# EAGLE design RFM50_Breakout_0 (EAGLE 6.3)
RFM50 Breakout Board w/SMD Crystal
AUTHOR: Pasakorn Tiwatthanont
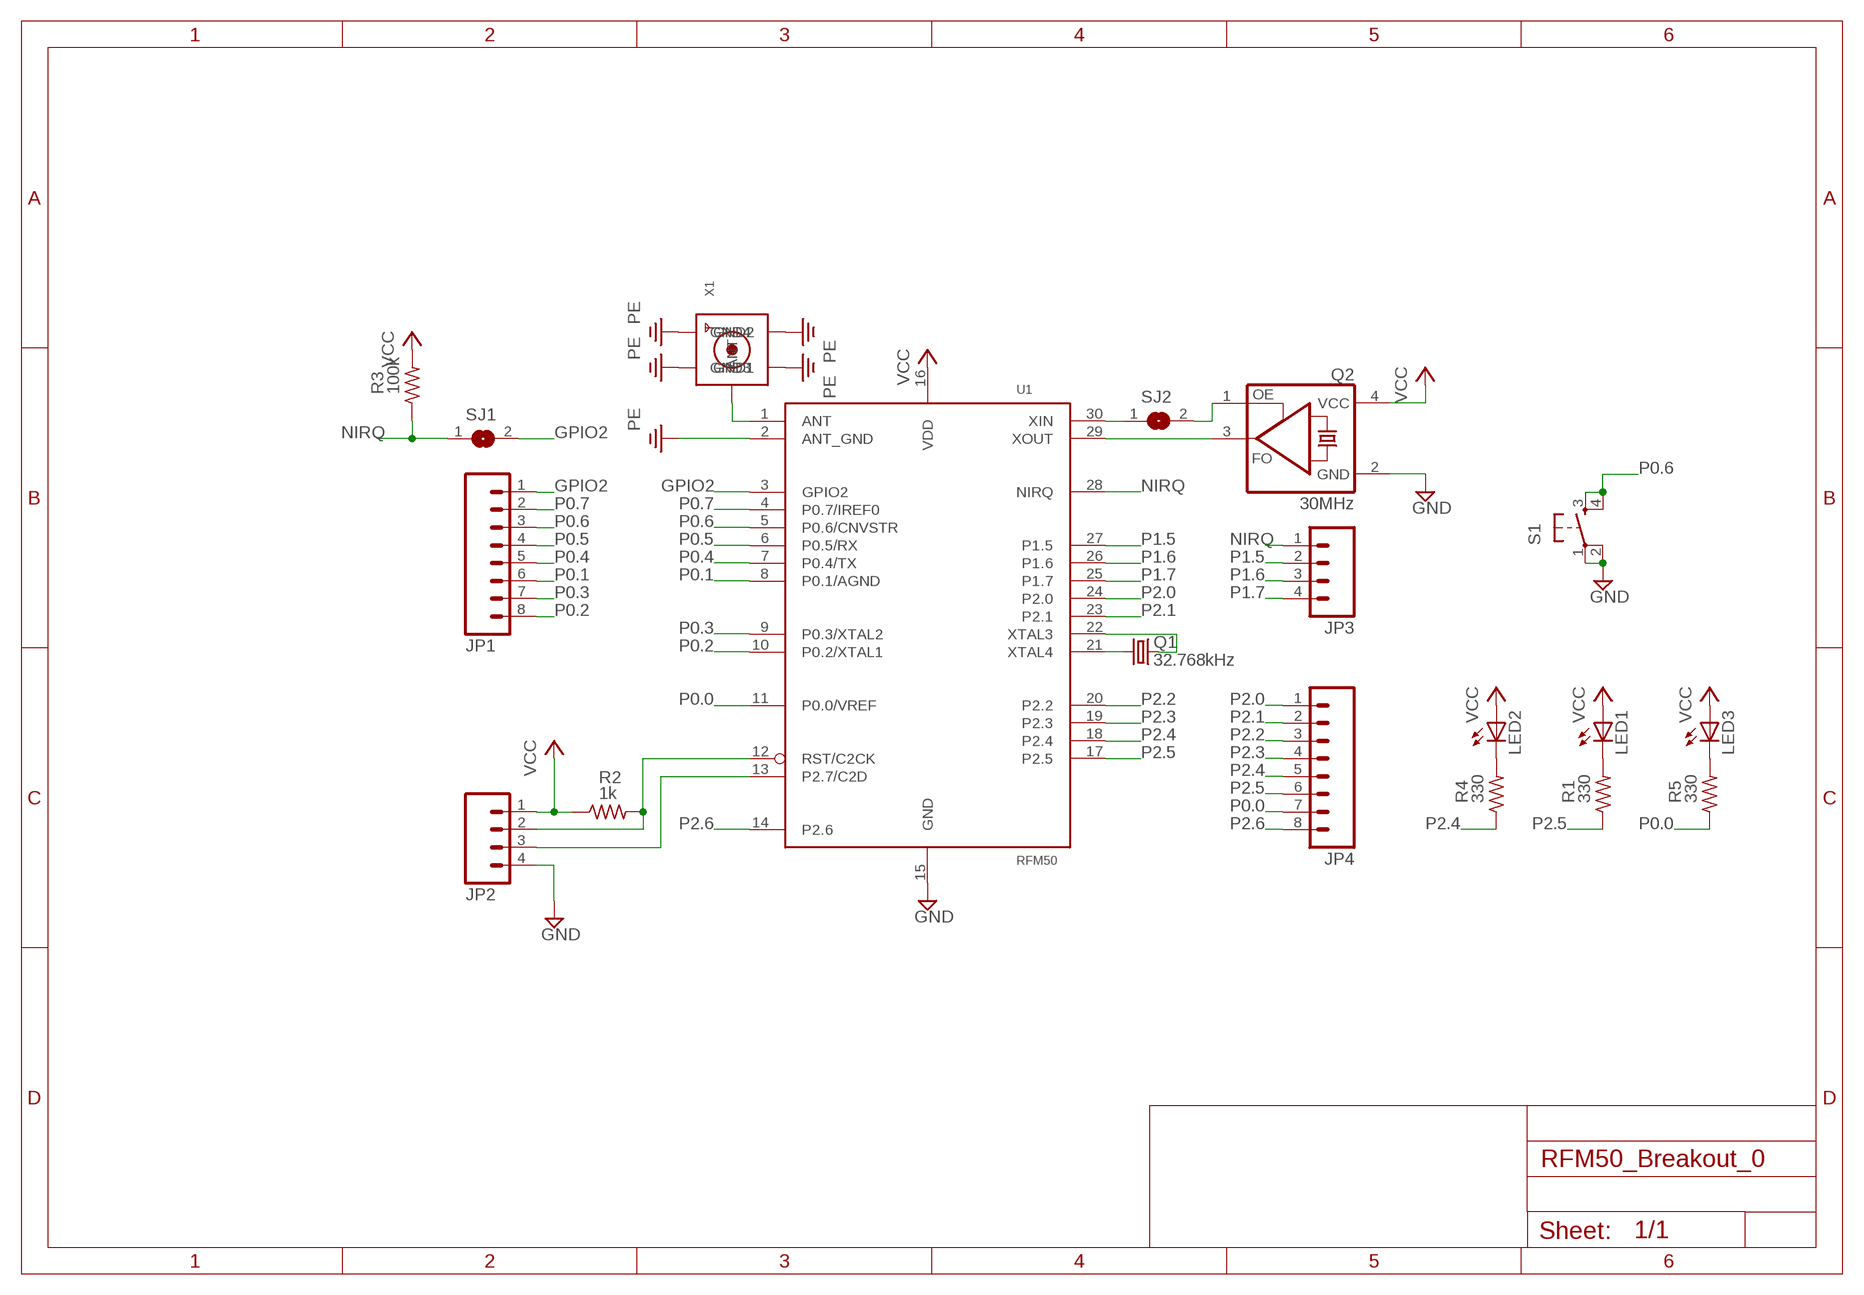
[diagram p0: schematic, sheet 1]

## Parts
JP1  M081X08  [1X08]
JP2  M04PTH  [1X04]
JP3  M04PTH  [1X04]
JP4  M081X08  [1X08]
LED1  LED3MM  [LED3MM]
LED2  LED3MM  [LED3MM]
LED3  LED3MM  [LED3MM]
Q1  32.768kHz  CRYSTALTC26H  [TC26H]
Q2  30MHz  ASFL  [ASF]
R1  330  RCL_R-US_0204/2V  [RCL_0204V]
R2  1k  RCL_R-US_0204/2V  [RCL_0204V]
R3  100k  RCL_R-US_R0805  [RCL_R0805]
R4  330  RCL_R-US_0204/2V  [RCL_0204V]
R5  330  RCL_R-US_0204/2V  [RCL_0204V]
S1  SWITCH-TACT_DTS-6  [SWITCH-TACT_DTS-6]
SJ1  SJ  [SJ]
SJ2  SJ  [SJ]
U1  RFM50  [RFM50]
X1  SMACONNECTOR  [SMA90_DIP]

## Nets
GND: JP2.4 Q2.2(GND) S1.1 S1.2 U1.15(GND)
GPIO2: JP1.1 SJ1.2 U1.3(GPIO2)
N$1: U1.1(ANT) X1.ANTENNA(ANT)
N$2: JP2.2 R2.2 U1.12(RST/C2CK)
N$3: LED1.K(C) R1.2
N$4: Q2.3(FO) U1.29(XOUT)
N$5: Q2.1(OE) SJ2.2
N$6: Q1.2 U1.21(XTAL4)
N$7: Q1.1 U1.22(XTAL3)
N$8: SJ2.1 U1.30(XIN)
N$9: JP2.3 U1.13(P2.7/C2D)
N$10: LED2.K(C) R4.2
N$11: LED3.K(C) R5.2
NIRQ: JP3.1 R3.1 SJ1.1 U1.28(NIRQ)
P0.0: JP4.7 R5.1 U1.11(P0.0/VREF)
P0.1: JP1.6 U1.8(P0.1/AGND)
P0.2: JP1.8 U1.10(P0.2/XTAL1)
P0.3: JP1.7 U1.9(P0.3/XTAL2)
P0.4: JP1.5 U1.7(P0.4/TX)
P0.5: JP1.4 U1.6(P0.5/RX)
P0.6: JP1.3 S1.3 S1.4 U1.5(P0.6/CNVSTR)
P0.7: JP1.2 U1.4(P0.7/IREF0)
P1.5: JP3.2 U1.27(P1.5)
P1.6: JP3.3 U1.26(P1.6)
P1.7: JP3.4 U1.25(P1.7)
P2.0: JP4.1 U1.24(P2.0)
P2.1: JP4.2 U1.23(P2.1)
P2.2: JP4.3 U1.20(P2.2)
P2.3: JP4.4 U1.19(P2.3)
P2.4: JP4.5 R4.1 U1.18(P2.4)
P2.5: JP4.6 R1.1 U1.17(P2.5)
P2.6: JP4.8 U1.14(P2.6)
PE: U1.2(ANT_GND) X1.GND1 X1.GND2 X1.GND3 X1.GND4
VCC: JP2.1 LED1.A LED2.A LED3.A Q2.4(VCC) R2.1 R3.2 U1.16(VDD)

## Library data of the parts
JP1 JP4 = SparkFun-Connectors:M08: Header 8 Standard 8-pin 0.1" header. Use with straight break away headers (SKU : PRT-00116), right angle break away headers (PRT-00553), swiss pins (PRT-00743), machine pins (PRT-00117), and female headers (PRT-00115).
JP2 JP3 = ipas:M04: Header 4 Standard 4-pin 0.1" header. Use with straight break away headers (SKU : PRT-00116), right angle break away headers (PRT-00553), swiss pins (PRT-00743), machine pins (PRT-00117), and female headers (PRT-00115). Molex polarized connector foot print use with SKU : PRT-08231 with associated crimp pins and housings. 1MM SMD Version SKU: PRT-10208
LED1-LED3 = led:LED: LED OSRAM: - CHIPLED LG R971, LG N971, LY N971, LG Q971, LY Q971, LO R971, LY R971 LH N974, LH R974 LS Q976, LO Q976, LY Q976 LO Q996 - Hyper CHIPLED LW Q18S LB Q993, LB Q99A, LB R99A - SideLED LS A670, LO A670, LY A670, LG A670, LP A670 LB A673, LV A673, LT A673, LW A673 LH A674 LY A675 LS A676, LA A676, LO A676, LY A676, LW A676 LS A679, LY A679, LG A679 - Hyper Micro SIDELED® LS Y876, LA Y876, LO Y876, LY Y876 LT Y87S - SmartLED LW L88C, LW L88S LB L89C, LB L89S, LG L890 LS L89K, LO L89K, LY L89K LS L896, LA L896, LO L896, LY L896 - TOPLED LS T670, LO T670, LY T670, LG T670, LP T670 LSG T670, LSP T670, LSY T670, LOP T670, LYG T670 LG T671, LOG T671, LSG T671 LB T673, LV T673, LT T673, LW T673 LH T674 LS T676, LA T676, LO T676, LY T676, LB T676, LH T676, LSB T676, LW T676 LB T67C, LV T67C, LT T67C, LS T67K, LO T67K, LY T67K, LW E67C LS E67B, LA E67B, LO E67B, LY E67B, LB E67C, LV E67C, LT E67C LW T67C LS T679, LY T679, LG T679 LS T770, LO T770, LY T770, LG T770, LP T770 LB T773, LV T773, LT T773, LW T773 LH T774 LS E675, LA E675, LY E675, LS T675 LS T776, LA T776, LO T776, LY T776, LB T776 LHGB T686 LT T68C, LB T68C - Hyper Mini TOPLED® LB M676 - Mini TOPLED Santana® LG M470 LS M47K, LO M47K, LY M47K Source: http://www.osram.convergy.de LUXEON: - LUMILED® LXK2-PW12-R00, LXK2-PW12-S00, LXK2-PW14-U00, LXK2-PW14-V00 LXK2-PM12-R00, LXK2-PM12-S00, LXK2-PM14-U00 LXK2-PE12-Q00, LXK2-PE12-R00, LXK2-PE12-S00, LXK2-PE14-T00, LXK2-PE14-U00 LXK2-PB12-K00, LXK2-PB12-L00, LXK2-PB12-M00, LXK2-PB14-N00, LXK2-PB14-P00, LXK2-PB14-Q00 LXK2-PR12-L00, LXK2-PR12-M00, LXK2-PR14-Q00, LXK2-PR14-R00 LXK2-PD12-Q00, LXK2-PD12-R00, LXK2-PD12-S00 LXK2-PH12-R00, LXK2-PH12-S00 LXK2-PL12-P00, LXK2-PL12-Q00, LXK2-PL12-R00 Source: www.luxeon.com KINGBRIGHT: KA-3528ASYC Source: www.kingbright.com
Q1 = crystal:CRYSTAL: CRYSTAL; OC_FARNELL: unknown; OC_NEWARK: unknown
Q2 = crystal:ASF*: CRYSTAL CLOCK OSCILLATORS 5.0 Vdc or 3.3 Vdc - LOW PROFILE ULTRA MINIATURE CERAMIC SURFACE MOUNT Source: http://www.abracon.com/Oscillators/asf1-L-L1.pdf; MPN: ASFLM1-50.000MHZ-C-T; OC_FARNELL: 1838931; OC_NEWARK: 99M0411
R1-R5 = ipas:RCL_R-US_: RESISTOR, American symbol
S1 = ipas:SWITCH-TACT_DTS-6: DTS-6 Series CONTACT RATING: 12VDC, 50mA (Max) CONTACT RESISTANCE: 100mΩ Max. www.aeontekasia.com/pdf/DTS-6.pdf
SJ1 SJ2 = jumper:SJ: SMD solder JUMPER
U1 = ipas:RFM50: RFM50 Module for Silabs Wireless SoC, Si1000.
X1 = ipas:SMACONNECTOR: SMA Connector 90° DIP SMA Connector, 50 Ohm (4UConnector: 07259)

## Board
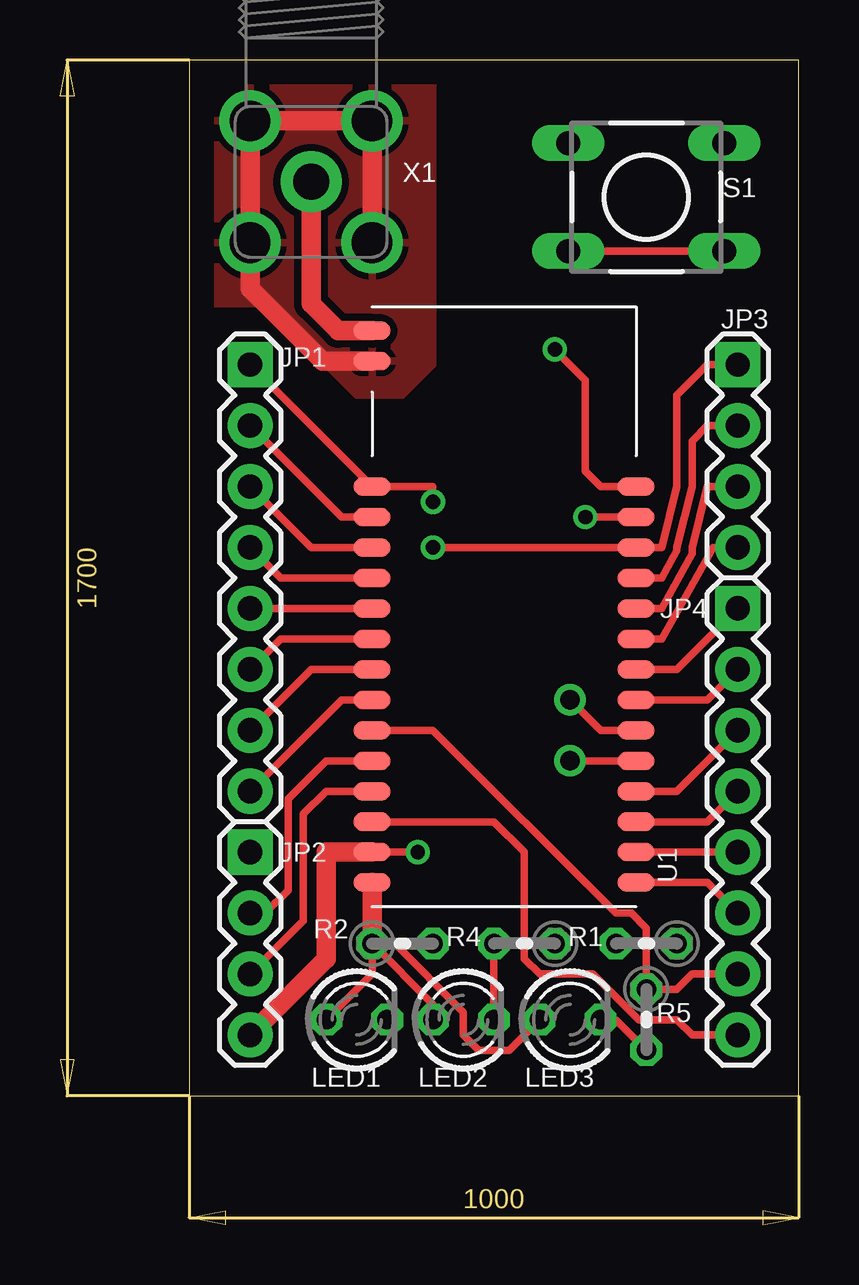
[diagram p1: board, top side]
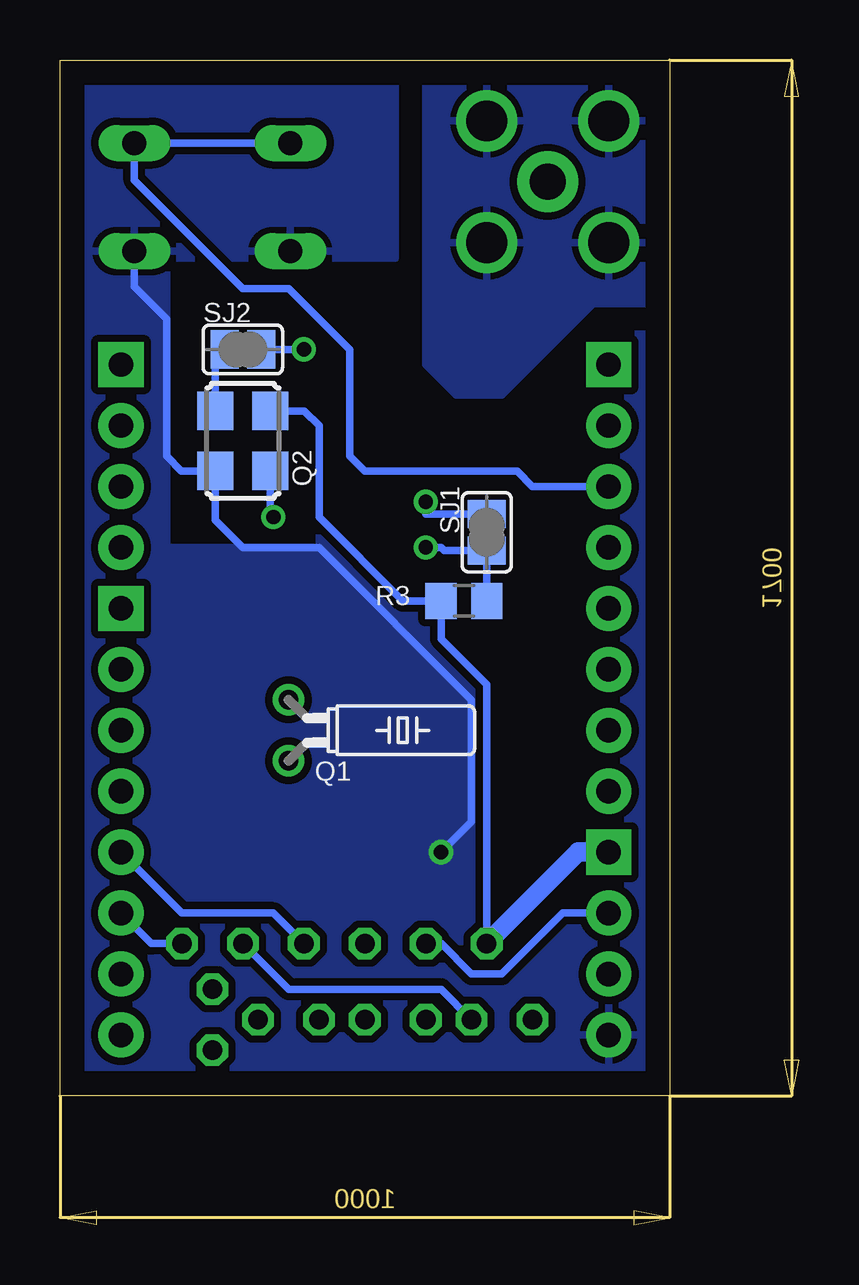
[diagram p2: board, bottom side, seen from below]

Size 25.4 x 43.18 mm. Coordinates in mm from the lower left corner, seen from the top.
Outline: 0,0 25.4,0 25.4,43.18 0,43.18 0,0
Copper layers (1*16): Top 0.035mm / dielectric 1.5mm / Bottom 0.035mm
Design rules "ipas *": minimum track width 12mil, minimum drill 20mil, track to track 12mil, track to pad 12mil, pad to pad 10mil, via to via 10mil, smd to smd 10mil, copper to edge 40mil, drill to drill 10mil, minimum pad ring 10mil, minimum via ring 8mil, stop-mask expansion 4mil, vias tented up to drill 0mil, thermal gap 10mil

### Footprints (pad centres in the part's own frame; a part is rotated, then mirrored left to right if it is on the bottom)
1X08 = drill 1.016 pad 1.88 square: 1 0,0 | drill 1.016 pad 1.88: 2 2.54,0; 3 5.08,0; 4 7.62,0; 5 10.16,0; 6 12.7,0; 7 15.24,0; 8 17.78,0
1X04 = drill 1.016 pad 1.88 square: 1 0,0 | drill 1.016 pad 1.88: 2 2.54,0; 3 5.08,0; 4 7.62,0
LED3MM = drill 0.813 octagon: A -1.27,0; K 1.27,0
TC26H = drill 0.813: 1 -1.27,0; 2 1.27,0
ASF = smd 1.6 x 1.5: 1 -1.25,-1.15; 2 1.25,-1.15; 3 1.25,1.15; 4 -1.25,1.15
RCL_0204V = drill 0.813 octagon: 1 -1.27,0; 2 1.27,0
RCL_R0805 = smd 1.3 x 1.5: 1 -0.95,0; 2 0.95,0
SWITCH-TACT_DTS-6 = drill 1 long: 1 -3.25,2.25; 2 3.25,2.25; 3 -3.25,-2.25; 4 3.25,-2.25
SJ = smd 1.168 x 1.6: 1 -0.762,0; 2 0.762,0
RFM50 = smd 1.524 x 0.762: 1 0,23; 2 0,21.73; 3 0,16.51; 4 0,15.24; 5 0,13.97; 6 0,12.7; 7 0,11.43; 8 0,10.16; 9 0,8.89; 10 0,7.62; 11 0,6.35; 12 0,5.08; 13 0,3.81; 14 0,2.54; 15 0,1.27; 16 0,0; 17 11,0; 18 11,1.27; 19 11,2.54; 20 11,3.81; 21 11,5.08; 22 11,6.35; 23 11,7.62; 24 11,8.89; 25 11,10.16; 26 11,11.43; 27 11,12.7; 28 11,13.97; 29 11,15.24; 30 11,16.51
SMA90_DIP = drill 1.5 pad 2.54: ANTENNA 0,0 | drill 1.7 pad 2.54: GND1 -2.54,2.54; GND2 2.54,2.54; GND3 -2.54,-2.54; GND4 2.54,-2.54

### Placement (x,y rotation side)
JP1  2.54,30.48 270 top
JP2  2.54,10.16 270 top
JP3  22.86,30.48 270 top
JP4  22.86,20.32 270 top
LED1  6.99,3.17 0 top
LED2  11.43,3.17 0 top
LED3  15.88,3.17 0 top
Q1  15.88,15.24 270 bottom
Q2  17.78,27.3 270 bottom
R1  19.05,6.35 180 top
R2  8.89,6.35 0 top
R3  8.57,20.64 180 bottom
R4  13.97,6.35 180 top
R5  19.05,3.17 270 top
S1  19.05,37.47 180 top
SJ1  7.62,23.5 90 bottom
SJ2  17.78,31.11 180 bottom
U1  7.62,8.89 0 top
X1  5.08,38.1 0 top

### Tracks (layer width: path | path; a pad name or v marks a point on that pad's centre or on a via)
GND  (via drill 0.6)
  Top 0.305: U1.15 v9.53,10.16 | S1.2 S1.1
  Top 0.813: U1.15 5.71,10.16 5.71,5.71 JP2.4
  Bottom 0.305: v9.53,10.16 8.26,11.43 8.26,16.51 14.61,22.86 17.78,22.86 18.93,24.01 Q2.2 20.34,26.05 20.95,26.67 20.95,32.38 22.3,33.73 S1.1
  pour Bottom: 0,0 0,31.75 2.54,31.75 6.35,27.94 9.53,27.94 11.43,29.84 11.43,34.29 14.61,34.29 14.61,22.86 20.95,22.86 20.95,34.92 11.43,34.92 11.43,43.18 25.4,43.18 25.4,0
GPIO2  (via drill 0.6)
  Top 0.305: JP1.1 U1.3 10.16,25.4 v10.16,24.77
  Bottom 0.305: SJ1.2 10.16,24.26 v10.16,24.77
N$1
  Top 0.813: U1.1 6.21,31.89 5.08,33.02 X1.ANTENNA
N$2
  Top 0.305: U1.12 5.71,13.97 4.13,12.38 4.13,8.57 3.17,7.62 JP2.2
  Bottom 0.305: JP2.2 4.45,7.62 6.99,5.08 8.26,5.08 9.53,6.35 R2.2
N$3
  Bottom 0.305: LED1.K 9.53,4.45 15.88,4.45 R1.2
N$4  (via drill 0.6)
  Top 0.305: U1.29 v16.51,24.13
  Bottom 0.305: Q2.3 16.63,24.25 v16.51,24.13
N$5
  Bottom 0.305: Q2.1 18.93,30.73 SJ2.2
N$6
  Top 0.305: U1.21 Q1.2
N$7
  Top 0.305: U1.22 17.14,15.24 Q1.1
N$8  (via drill 0.6)
  Top 0.305: U1.30 17.14,25.4 16.51,26.04 16.51,29.84 v15.24,31.11
  Bottom 0.305: v15.24,31.11 SJ2.1
N$9
  Top 0.305: U1.13 5.71,12.7 4.76,11.75 4.76,7.3 JP2.3
N$10
  Top 0.305: LED2.K R4.2
N$11
  Top 0.305: LED3.K 17.78,3.17 R5.2
NIRQ  (via drill 0.6)
  Top 0.305: JP3.1 21.59,30.48 20.32,29.21 20.32,25.4 19.68,22.86 U1.28 v10.16,22.86
  Bottom 0.305: v10.16,22.86 9.53,22.86 9.4,22.73 SJ1.1 R3.1
P0.0
  Top 0.305: U1.11 10.16,15.24 17.78,7.62 18.41,7.62 19.05,6.99 R5.1 20.32,4.45 20.95,5.08 JP4.7
P0.1
  Top 0.305: JP1.6 3.81,19.05 U1.8
P0.2
  Top 0.305: JP1.8 6.35,16.51 U1.10
P0.3
  Top 0.305: JP1.7 5.08,17.78 U1.9
P0.4
  Top 0.305: JP1.5 U1.7
P0.5
  Top 0.305: JP1.4 3.81,21.59 U1.6
P0.6
  Top 0.305: JP1.3 5.08,22.86 U1.5
  Bottom 0.305: S1.4 S1.3 22.3,38.17 17.78,33.66 15.88,33.66 13.34,31.11 13.34,26.67 12.7,26.04 6.35,26.04 5.71,25.4 JP1.3
P0.7
  Top 0.305: JP1.2 6.35,24.13 U1.4
P1.5
  Top 0.305: U1.27 19.68,21.59 20.32,22.73 20.32,22.86 20.95,25.4 20.95,27.3 21.59,27.94 JP3.2
P1.6
  Top 0.305: U1.26 19.68,20.32 20.95,22.61 20.95,22.86 21.59,25.4 JP3.3
P1.7
  Top 0.305: U1.25 19.68,19.05 21.84,22.86 JP3.4
P2.0
  Top 0.305: U1.24 20.32,17.78 JP4.1
P2.1
  Top 0.305: U1.23 21.59,16.51 JP4.2
P2.2
  Top 0.305: U1.20 20.32,12.7 JP4.3
P2.3
  Top 0.305: U1.19 21.59,11.43 JP4.4
P2.4
  Top 0.305: U1.18 JP4.5
  Bottom 0.305: R4.1 16.51,7.62 20.32,7.62 JP4.5
P2.5
  Top 0.305: U1.17 21.59,8.89 JP4.6
  Bottom 0.305: R1.1 21.59,6.35 JP4.6
P2.6
  Top 0.305: U1.14 12.7,11.43 13.97,10.16 13.97,5.71 14.61,5.08 16.83,5.08 18.73,3.17 20.32,3.17 20.95,2.54 JP4.8
PE
  Top 0.813: U1.2 5.58,30.62 2.54,33.66 X1.GND3 X1.GND1 X1.GND2 X1.GND4
  pour Top: 0,33.02 3.17,33.02 6.99,29.21 8.89,29.21 10.16,30.48 10.16,43.18 0,43.18
  pour Bottom: 0,33.02 3.17,33.02 6.99,29.21 8.89,29.21 10.16,30.48 10.16,43.18 0,43.18
VCC
  Top 0.305: LED1.A 7.62,5.08 R2.1 | R2.1 8.57,6.35 11.43,3.49 11.43,2.54 12.06,1.91 13.34,1.91 LED3.A | LED2.A 10.16,3.81 R2.1
  Top 0.813: U1.16 R2.1
  Bottom 0.305: R2.1 7.62,17.14 9.53,19.05 R3.2 11.11,20.64 14.61,24.13 14.61,27.94 15.22,28.55 Q2.4 16.61,28.57
  Bottom 0.813: JP2.1 3.81,10.16 R2.1